# Altium schematic sheet UNI-DIRECTIONAL HIGH-SIDE SWITCH 10V.SchDoc
size A3; SheetNumber: 9; SheetTotal: 9
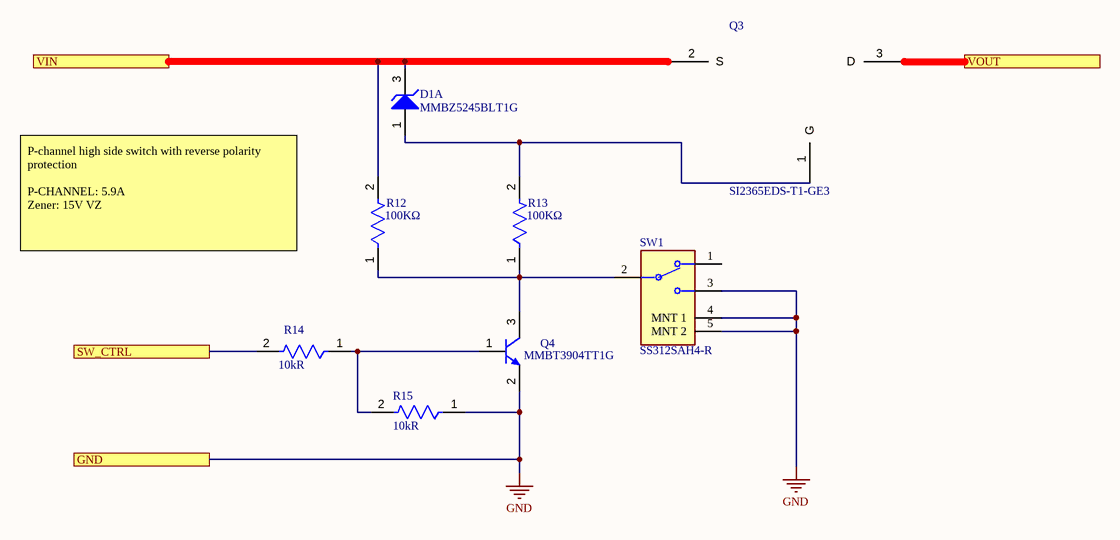
[diagram p0: UNI-DIRECTIONAL HIGH-SIDE SWITCH 10V.SchDoc]

## Parts
D1  MMBZ5245BLT1G  [ONSC-SOT-23-3-318-08_V]  (part A of 2)
Q3  SI2365EDS-T1-GE3  [SOT95P237X110-3M]
Q4  MMBT3904TT1G  [ONSC-SC-75-3-463-01_V]
R12  Resistance: 100KΩ  [FP-RT0402-MFG]  (hidden comment: RT0402FRE07100KL)
R13  Resistance: 100KΩ  [FP-RT0402-MFG]  (hidden comment: RT0402FRE07100KL)
R14  Resistance: 10kR  [FP-CRG0402-IPC_B]  (hidden comment: CRG0402F10K)
R15  Resistance: 10kR  [FP-CRG0402-IPC_B]  (hidden comment: CRG0402F10K)
SW1  SS312SAH4-R  [FP-SS312SAH4-R-MFG]

## Ports
GND, SW_CTRL, VIN, VOUT

## Nets
GND: Q4.2(E) R15.1 SW1.3 SW1.4(MNT_1) SW1.5(MNT_2) ; port GND
SW_CTRL: R14.2 ; port SW_CTRL
VIN: D1.3(K) Q3.2(S) R12.2 ; port VIN
VOUT: Q3.3(D) ; port VOUT
NetD1_1: D1.1(A) Q3.1(G) R13.2
NetQ4_1: Q4.1(B) R14.1 R15.2
NetQ4_3: Q4.3(C) R12.1 R13.1 SW1.2(COM)

Not connected (* = marked no-connect by the designer): SW1 1

## Notes on the sheet
- P-channel high side switch with reverse polarity protection
  P-CHANNEL: 5.9A
  Zener: 15V VZ
- Sheet Title
- PCB Project Name
- Modified
- Sheet
- of

## Library data of the parts
D1 = CMP-1060-01179-1: Zener Voltage Regulator, 225 mW, 3-Pin SOT-23, Pb-Free, Tape and Reel; Manufacturer: On Semiconductor; VZ Typ (V): 15; PackageDescription: 3-Pin Small Outline Transistor, Body 2.92 x 1.3 mm, Pitch 0.95 mm; ComponentLink1Description: Manufacturer URL; PackageVersion: Rev. AP, 11/2009; Mounting Technology: Surface Mount; PartNumber: MMBZ5245BLT1G; Packing: Tape and Reel; ComponentLink2URL: http://www.onsemi.cn/pub_link/Collateral/MMBZ5221BLT1-D.PDF; ComponentLink1URL: http://www.onsemi.com/; ComponentLink2Description: Datasheet; ComponentLink3Description: Package Specification; DatasheetVersion: Rev. 12; PackageReference: SOT-23-3-318-08; RoHS: Pb-Free; ComponentLink3URL: http://www.onsemi.cn/pub_link/Collateral/318-08.PDF
Q3 = SI2365EDS-T1-GE3: Small Signal Field-Effect Transistor, 5.9A I(D), 20V, 1-Element, P-Channel, Silicon, Metal-oxide Semiconductor FET, TO-236AB; Manufacturer: Vishay Siliconix; Package Body Material: Plastic; Drain-source On Resistance-Max: 41mR; Number of Elements: 1; Operating Mode: ENHANCEMENT MODE; Power Dissipation-Max (Abs): 1.7W; Time @ Peak Reflow Temperature-Max (s): 30s; Transistor Application: SWITCHING; Supplier: Avnet; Supplier Part Number: 70AC6497; Manufacturer Part Number: SI2365EDS-T1-GE3; RoHS: Yes; Category: MOSFETs; Stock: 3000; Pricing: 1=0.39, 25=0.237, 50=0.18, 100=0.123, 250=0.167 (USD); Pins: 3; Package Shape: Rectangular; Terminal Finish: Tin; Transistor Element Material: SILICON; Max Operating Temperature: 150°C; JESD-609 Code: e3; Polarity/Channel Type: P-CHANNEL; Drain Current-Max (Abs) (ID): 5.9A; Drain Current-Max (ID): 5.9A; DS Breakdown Voltage-Min: 20V; FET Technology: METAL-OXIDE SEMICONDUCTOR; JESD-30 Code: R-PDSO-G3; Moisture Sensitivity Level: 1; Package Style: SMALL OUTLINEMeter; Peak Reflow Temperature (Cel): 260°C; Surface Mount: Yes; Terminal Form: Gull Wing; Terminal Position: DUAL; JEDEC-95 Code: TO-236AB; Reach SVHC Compliant: Yes; RoHS Compliant: Yes; ComponentLink1URL: https://datasheet.ciiva.com:443/pdfs/VipMasterIC/IC/VISH/VISH-S-A0001142567/VISH-S-A0001142567-1.pdf?src-supplier=IHS+Markit; ComponentLink1Description: https://datasheet.ciiva.com:443/pdfs/VipMasterIC/IC/VISH/VISH-S-A0001142567/VISH-S-A0001142567-1.pdf?src-supplier=IHS+Markit; ComponentLink2URL: https://datasheet.ciiva.com/6376/si2365eds-6376289.pdf?src-supplier=Digikey; ComponentLink2Description: https://datasheet.ciiva.com/6376/si2365eds-6376289.pdf?src-supplier=Digikey; ComponentLink3URL: https://datasheet.ciiva.com/6376/si2365eds-6376283.pdf?src-supplier=Digikey; ComponentLink3Description: https://datasheet.ciiva.com/6376/si2365eds-6376283.pdf?src-supplier=Digikey
Q4 = CMP-1048-00420-1: General Purpose Transistor, NPN Silicon, 3-Pin SC-75, Pb-Free, Tape and Reel; Manufacturer: On Semiconductor; IC Continuous (A): 0.2; fT Min (MHz): 300; ComponentLink3URL: http://www.onsemi.com/pub_link/Collateral/463-01.PDF; DatasheetVersion: Rev. 5; RoHS: TRUE; Mounting Technology: Surface Mount; ComponentLink1URL: http://www.onsemi.com/; ComponentLink3Description: Package Specification; PackageReference: SC-75-3-463-01; Polarity: NPN; ComponentLink2Description: Datasheet; PackageVersion: Rev. F, 07/2005; PartNumber: MMBT3904TT1G; ComponentLink2URL: http://www.onsemi.cn/pub_link/Collateral/MMBT3904TT1-D.PDF; ComponentLink1Description: Manufacturer URL; PackageDescription: 3-Pin Small Outline Transistor, Body 1.6 x 0.8 mm, Pitch 0.5 mm; Packing: Tape and Reel
R12 R13 = CMP-2002-02553-2: RES 100K OHM 1/16W 1% SMD 0402; Manufacturer: Yageo; Temperature Coefficient: 50 ppm/°C; Voltage Rating: 50V; Power Rating: 0.063W; Tolerance: 0.01; Value: 100KΩ; Manufacturer Part Number: RT0402FRE07100KL; Mouser Description: Res Thin Film 0402 100K Ohm 1% 0.063W(1/16W) ???}50ppm/???? Molded SMD Paper T/R; Package: RT0402; Composition: Thin Film; Series: RT; Footprint Url: http://www.yageo.com/exep/pages/download/literatures/PYu-R_Mount_10.pdf; ComponentLink2Description: Datasheet; Digikey Description: RES 100K OHM 1/16W 1% SMD 0402; Device Class L3: Chip SMD Resistors; ComponentLink2URL: http://www.yageo.com/documents/recent/PYu-RT_1-to-0.01_RoHS_L_9.pdf; Lead Free: Yes; Ipc Land Pattern Name: RESC10050X30; Temperature: -55°C to +155°C; Octopart: https://octopart.com/rt0402fre07100kl-yageo-1444458; RoHS: TRUE; Device Class L1: Passive Components; Height: 0.35mm; Temperature Range High: +155°C; Category: Res; Automotive: No; Temperature Range Low: -55°C; Device Class L2: Resistors
R14 R15 = CMP-03211-011410-1: RES SMD 10K OHM 1% 1/16W 0402; Voltage Rating (DC): 50V; Temperature Coefficient: 100ppm/°C; Max Power Dissipation: 63mW; Number of Resistors: 1; Max Operating Temperature: 125°C; Mount: Surface Mount; Length: 1mm; Lead Free: Lead Free; Min Operating Temperature: -55°C; Termination: Solder; Military Standard: Not; Width: 0.02inch; Case Code (Imperial): 0402; Construction: Rectangular; Resistance Tolerance: 1%; RoHS Compliant: Yes; Voltage Rating: 50V; Height: 0.35mm; Radiation Hardening: No; Depth: 0.5mm; Resistor Type: Thick Film; Number of Terminations: 2; Packaging: Tape and Reel; Series: CRG, Neohm; ELV: Compliant; Power Rating: 63mW; Case/Package: 0402; Technology: THICK FILM; Tolerance: 1%; REACH SVHC: No SVHC; Package Quantity: 10000
SW1 = CMP-31746-000001-1: SWITCH SLIDE SPDT 0.4VA 28V; Mechanical Life: 10000Cycles; Switch Function: On-On; Actuator Length: 2mm; Contact Style: Shorting; Max Current Rating: 100mA; Actuator Type: Standard; Actuator Material: Polyphenylene; Length: 10.5mm; Orientation: Right Angle; Voltage Rating (DC): 28V; Contact Material: Bronze; Electrical Life: 10000Cycles; Max Operating Temperature: 85°C; Case/Package: SMD/SMT; Depth: 7.45mm; Contact Plating: Gold; Voltage Rating (AC): 28V; Package Quantity: 1; Min Operating Temperature: -25°C; Switch Travel: 2mm; Housing Material: Bronze; RoHS Compliant: Yes; Lead Free: Lead Free; Termination: Gull Wing; Packaging: Tape and Reel; REACH SVHC: No SVHC; Mount: Surface Mount; Series: SS3; Throw Configuration: SPDT; Max Voltage Rating (AC): 28V; Max Voltage Rating (DC): 28V